# Altium schematic sheet DSP_GPIO_Part3.SchDoc
size A4
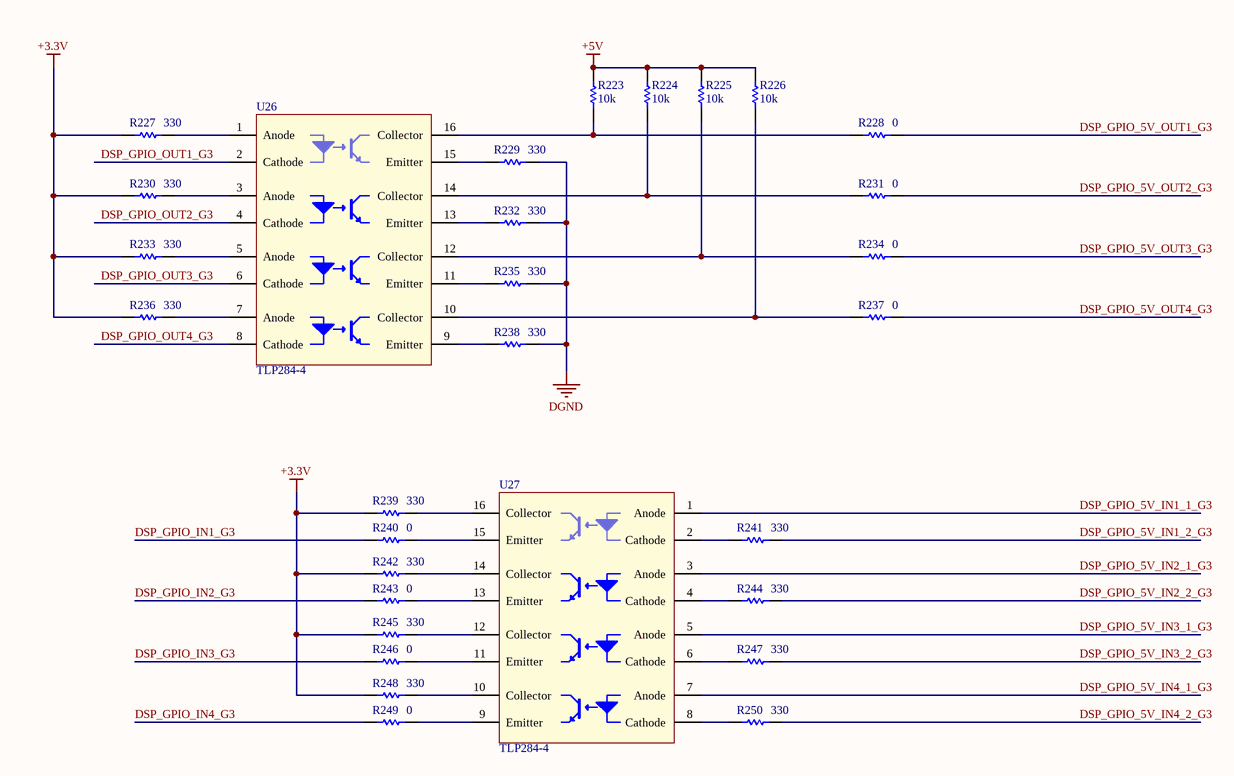
[diagram p0: DSP_GPIO_Part3.SchDoc]

## Parts
R223  value 10k  [1608[0603]]  (hidden comment: Res1)
R224  value 10k  [1608[0603]]  (hidden comment: Res1)
R225  value 10k  [1608[0603]]  (hidden comment: Res1)
R226  value 10k  [1608[0603]]  (hidden comment: Res1)
R227  value 330  [1608[0603]]  (hidden comment: Res1)
R228  value 0  [1608[0603]]  (hidden comment: Res1)
R229  value 330  [1608[0603]]  (hidden comment: Res1)
R230  value 330  [1608[0603]]  (hidden comment: Res1)
R231  value 0  [1608[0603]]  (hidden comment: Res1)
R232  value 330  [1608[0603]]  (hidden comment: Res1)
R233  value 330  [1608[0603]]  (hidden comment: Res1)
R234  value 0  [1608[0603]]  (hidden comment: Res1)
R235  value 330  [1608[0603]]  (hidden comment: Res1)
R236  value 330  [1608[0603]]  (hidden comment: Res1)
R237  value 0  [1608[0603]]  (hidden comment: Res1)
R238  value 330  [1608[0603]]  (hidden comment: Res1)
R239  value 330  [1608[0603]]  (hidden comment: Res1)
R240  value 0  [1608[0603]]  (hidden comment: Res1)
R241  value 330  [1608[0603]]  (hidden comment: Res1)
R242  value 330  [1608[0603]]  (hidden comment: Res1)
R243  value 0  [1608[0603]]  (hidden comment: Res1)
R244  value 330  [1608[0603]]  (hidden comment: Res1)
R245  value 330  [1608[0603]]  (hidden comment: Res1)
R246  value 0  [1608[0603]]  (hidden comment: Res1)
R247  value 330  [1608[0603]]  (hidden comment: Res1)
R248  value 330  [1608[0603]]  (hidden comment: Res1)
R249  value 0  [1608[0603]]  (hidden comment: Res1)
R250  value 330  [1608[0603]]  (hidden comment: Res1)
U26  TLP284-4  [TLP284-4]
U27  TLP284-4  [TLP284-4]

## Nets
+3.3V: R227.1 R230.1 R233.1 R236.1 R239.1 R242.1 R245.1 R248.1
+5V: R223.2 R224.2 R225.2 R226.2
DGND: R229.2 R232.2 R235.2 R238.2
DSP_GPIO_5V_IN1_1_G3: U27.1(Anode)
DSP_GPIO_5V_IN1_2_G3: R241.2
DSP_GPIO_5V_IN2_1_G3: U27.3(Anode)
DSP_GPIO_5V_IN2_2_G3: R244.2
DSP_GPIO_5V_IN3_1_G3: U27.5(Anode)
DSP_GPIO_5V_IN3_2_G3: R247.2
DSP_GPIO_5V_IN4_1_G3: U27.7(Anode)
DSP_GPIO_5V_IN4_2_G3: R250.2
DSP_GPIO_5V_OUT1_G3: R228.2
DSP_GPIO_5V_OUT2_G3: R231.2
DSP_GPIO_5V_OUT3_G3: R234.2
DSP_GPIO_5V_OUT4_G3: R237.2
DSP_GPIO_IN1_G3: R240.1
DSP_GPIO_IN2_G3: R243.1
DSP_GPIO_IN3_G3: R246.1
DSP_GPIO_IN4_G3: R249.1
DSP_GPIO_OUT1_G3: U26.2(Cathode)
DSP_GPIO_OUT2_G3: U26.4(Cathode)
DSP_GPIO_OUT3_G3: U26.6(Cathode)
DSP_GPIO_OUT4_G3: U26.8(Cathode)
NetR223_1: R223.1 R228.1 U26.16(Collector)
NetR224_1: R224.1 R231.1 U26.14(Collector)
NetR225_1: R225.1 R234.1 U26.12(Collector)
NetR226_1: R226.1 R237.1 U26.10(Collector)
NetR227_2: R227.2 U26.1(Anode)
NetR229_1: R229.1 U26.15(Emitter)
NetR230_2: R230.2 U26.3(Anode)
NetR232_1: R232.1 U26.13(Emitter)
NetR233_2: R233.2 U26.5(Anode)
NetR235_1: R235.1 U26.11(Emitter)
NetR236_2: R236.2 U26.7(Anode)
NetR238_1: R238.1 U26.9(Emitter)
NetR239_2: R239.2 U27.16(Collector)
NetR240_2: R240.2 U27.15(Emitter)
NetR241_1: R241.1 U27.2(Cathode)
NetR242_2: R242.2 U27.14(Collector)
NetR243_2: R243.2 U27.13(Emitter)
NetR244_1: R244.1 U27.4(Cathode)
NetR245_2: R245.2 U27.12(Collector)
NetR246_2: R246.2 U27.11(Emitter)
NetR247_1: R247.1 U27.6(Cathode)
NetR248_2: R248.2 U27.10(Collector)
NetR249_2: R249.2 U27.9(Emitter)
NetR250_1: R250.1 U27.8(Cathode)

## Library data of the parts
R223-R250 = Res1: Resistor; Published: 8-Jun-2000; LatestRevisionDate: 17-Jul-2002; LatestRevisionNote: Re-released for DXP Platform.; PackageReference: AXIAL-0.3; Publisher: Altium Limited; PackageDescription: Axial Device, Thru-Hole; 2 Leads; 0.3 in Pin Spacing